# Altium project UltraZohm_Analog_Adapter_MAX11331.PrjPcb
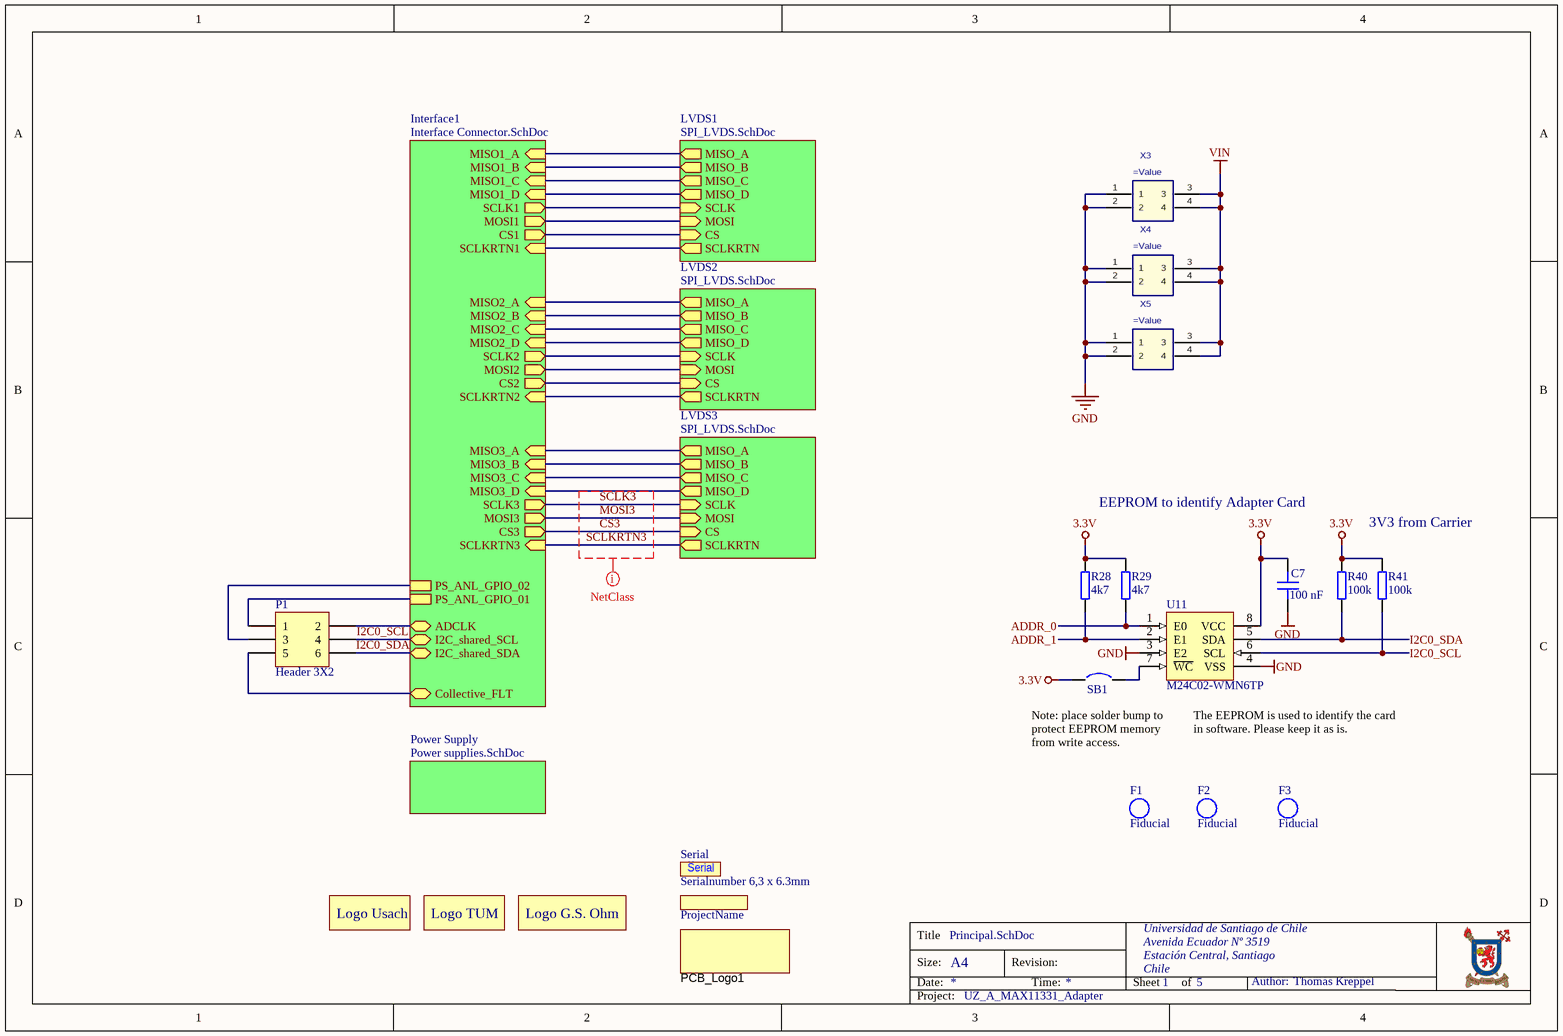
[diagram p0: Principal.SchDoc]
Author: Thomas Kreppel; Date: 10/2025; ProjectName: UZ_A_MAX11331_Adapter; ProjectRevision: Rev03
4 sheets, 150 parts. Net scope: hierarchical (ports join the sheet entries above them; power ports are global).
Board file: UltraZohm_Analog_Adapter_MAX11331.PcbDoc
Sheets:
  Principal.SchDoc
    Power Supply = Power supplies.SchDoc
    Interface1 = Interface Connector.SchDoc
    LVDS1 = SPI_LVDS.SchDoc
    LVDS2 = SPI_LVDS.SchDoc
    LVDS3 = SPI_LVDS.SchDoc

## Sheet Principal.SchDoc
size A4; Author: Thomas Kreppel; CompanyName: Universidad de Santiago de Chile; Address1: Avenida Ecuador Nº 3519; Address2: Estación Central, Santiago; Address3: Chile; DocumentNumber: 1; Revision: Rev03; SheetNumber: 1; SheetTotal: 5

### Parts
C7  100 nF  [C_0603]
F1  Fiducial  [Fiducial_1.7mm]  (no BOM)
F2  Fiducial  [Fiducial_1.7mm]  (no BOM)
F3  Fiducial  [Fiducial_1.7mm]  (no BOM)
Logo1  LOGO USACH  [Logo Usach]  (value not drawn)  (no BOM)
Logo2  LOGO TUM  [Logo TUM]  (value not drawn)  (no BOM)
Logo3  LOGO G.S. Ohm  [Logo G.S.Ohm University]  (value not drawn)  (no BOM)
P1  Header 3X2  [HDR2X3]  (no BOM)
PCB_Logo1  ESD Susceptible  [ESD_Overlay_Medium]  (value not drawn)  (no BOM)
ProjectName  Project Name, Rev  [ID_ProjectRev]  (value not drawn)  (no BOM)
R28  4k7  [RES 0603_1608]
R29  4k7  [RES 0603_1608]
R40  100k  [RES 0603_1608]
R41  100k  [RES 0603_1608]
SB1  Solder Bump 0603  [SB_0603]  (value not drawn)  (no BOM)
Serial  Serialnumber 6,3 x 6.3mm  [Serial_6.3x6.3mm]  (no BOM)
U11  M24C02-WMN6TP  [D0008A_N]
X3  (no value)  [IPL1-102-01-L-D-K]
X4  (no value)  [IPL1-102-01-L-D-K]
X5  (no value)  [IPL1-102-01-L-D-K]

### Sub-sheets
Interface1 = Interface Connector.SchDoc: MISO2_B (in), MOSI3 (out), SCLK1 (out), MISO3_A (in), SCLK2 (out), CS1 (out), MISO1_A (in), MISO1_C (in), MISO2_C (in), PS_ANL_GPIO_02, MOSI1 (out), Collective_FLT (bidir), SCLKRTN2 (in), MOSI2 (out), SCLKRTN3 (in), MISO3_B (in), CS2 (out), SCLKRTN1 (in), ADCLK (bidir), MISO1_D (in), CS3 (out), MISO3_D (in), MISO3_C (in), MISO1_B (in), MISO2_A (in), MISO2_D (in), I2C_shared_SDA (bidir), PS_ANL_GPIO_01, SCLK3 (out), I2C_shared_SCL (bidir)
LVDS1 = SPI_LVDS.SchDoc: SCLKRTN (out), MOSI (in), MISO_C (out), MISO_A (out), MISO_D (out), MISO_B (out), SCLK (in), CS (in)
LVDS2 = SPI_LVDS.SchDoc: SCLKRTN (out), MOSI (in), MISO_C (out), MISO_A (out), MISO_D (out), MISO_B (out), SCLK (in), CS (in)
LVDS3 = SPI_LVDS.SchDoc: SCLKRTN (out), MOSI (in), MISO_C (out), MISO_A (out), MISO_D (out), MISO_B (out), SCLK (in), CS (in)
Power Supply = Power supplies.SchDoc: no entries

### Nets
3.3V: C7.1 R28.2 R29.2 R40.2 R41.2 SB1.1 U11.8(VCC)
GND: C7.2 U11.3(E2) U11.4(VSS) X3.1 X3.2 X4.1 X4.2 X5.1 X5.2
VIN: X3.3 X3.4 X4.3 X4.4 X5.3 X5.4
ADCLK: P1.2 ; sheet Interface1/ADCLK
ADDR_0: R29.1 U11.1(E0)
ADDR_1: R28.1 U11.2(E1)
Collective_FLT: P1.5 ; sheet Interface1/Collective_FLT
CS: sheet Interface1/CS2, sheet LVDS2/CS
CS1: sheet Interface1/CS1, sheet LVDS1/CS
CS3: sheet Interface1/CS3, sheet LVDS3/CS
I2C0_SCL: P1.4 R41.1 U11.6(SCL) ; sheet Interface1/I2C_shared_SCL
I2C0_SDA: P1.6 R40.1 U11.5(SDA) ; sheet Interface1/I2C_shared_SDA
MISO1_A: sheet Interface1/MISO1_A, sheet LVDS1/MISO_A
MISO1_B: sheet Interface1/MISO1_B, sheet LVDS1/MISO_B
MISO1_C: sheet Interface1/MISO1_C, sheet LVDS1/MISO_C
MISO1_D: sheet Interface1/MISO1_D, sheet LVDS1/MISO_D
MISO2_A: sheet Interface1/MISO2_A, sheet LVDS2/MISO_A
MISO2_B: sheet Interface1/MISO2_B, sheet LVDS2/MISO_B
MISO2_C: sheet Interface1/MISO2_C, sheet LVDS2/MISO_C
MISO2_D: sheet Interface1/MISO2_D, sheet LVDS2/MISO_D
MISO3_A: sheet Interface1/MISO3_A, sheet LVDS3/MISO_A
MISO3_B: sheet Interface1/MISO3_B, sheet LVDS3/MISO_B
MISO3_C: sheet Interface1/MISO3_C, sheet LVDS3/MISO_C
MISO3_D: sheet Interface1/MISO3_D, sheet LVDS3/MISO_D
MOSI1: sheet Interface1/MOSI1, sheet LVDS1/MOSI
MOSI2: sheet Interface1/MOSI2, sheet LVDS2/MOSI
MOSI3: sheet Interface1/MOSI3, sheet LVDS3/MOSI
PS_ANL_GPIO_01: P1.1 ; sheet Interface1/PS_ANL_GPIO_01
PS_ANL_GPIO_02: P1.3 ; sheet Interface1/PS_ANL_GPIO_02
SCLK1: sheet Interface1/SCLK1, sheet LVDS1/SCLK
SCLK2: sheet Interface1/SCLK2, sheet LVDS2/SCLK
SCLK3: sheet Interface1/SCLK3, sheet LVDS3/SCLK
SCLKRTN: sheet Interface1/SCLKRTN1, sheet LVDS1/SCLKRTN
SCLKRTN: sheet Interface1/SCLKRTN2, sheet LVDS2/SCLKRTN  [a separate net that carries the same name]
SCLKRTN3: sheet Interface1/SCLKRTN3, sheet LVDS3/SCLKRTN
NetSB1_2: SB1.2 U11.7(~{WC})

### Layout directives
net class SPI_C: CS3, MOSI3, SCLK3, SCLKRTN3

### Notes on the sheet
- EEPROM to identify Adapter Card
- 3V3 from Carrier
- Note: place solder bump to protect EEPROM memory from write access.
- (near U11) The EEPROM is used to identify the card in software. Please keep it as is.
- Title
- Size:
- Date:
- A4
- Revision:
- Time:
- Sheet
- of
- Author:
- Project:
- (in symbol LOGO G.S. Ohm) Logo G.S. Ohm
- (in symbol LOGO TUM) Logo TUM
- (in symbol LOGO USACH) Logo Usach

### Library data of the parts
C7 = C0603C104K9PACTU: Capacitor 0603, 6.3 VDC, 100 nF, X5R; Manufacturer: KEMET; Tolerance: 10 %; Voltage Rating: 6.3 VDC; Created from: MGremer; Manufacturer Part Number: C0603C104K9PACTU; PartID: 70; Created On: 20.12.2020 13:54:13; ComponentLink1Description: Datasheet; ComponentLink1URL: https://www.mouser.de/datasheet/2/212/KEM_C1006_X5R_SMD-1103249.pdf; Component Type: Capacitor 0603; Device Package: 0603; Last Updated: 20.01.2021 13:57:36; Mounting Type: SMD; Operating Temperature: -55 - 85°C; Series: SMD Comm X5R; Supplier 1: Mouser; Supplier Part Number 1: 80-C0603C104K9P; Type: Capacitor; Value: 100 nF; Live Cycle Status: 1; Stock number: not stored; LCSC Part Number: C14663
F1-F3 = Fiducial: Fiducial for Assembler
P1 = Header 3X2: Header, 3-Pin, Dual row; LatestRevisionDate: 17-Jul-2002; LatestRevisionNote: Re-released for DXP Platform.; Publisher: Altium Limited
PCB_Logo1 = LOGO_ESD_Susceptible: ESD Susceptible Symbol; Created: 2018_11_25_AGeiger; Value: ESD Susceptible
ProjectName = ID_ProjectRev: Project Name and Revision Number; Created: 2018_11_23_AGeiger; Value: Project Name, Rev
R28 R29 = 0603WAF4701T5E: SMD resistor E24 series; Manufacturer: UNI-ROYAL; Tolerance: 1%; Created from: AGeiger; Manufacturer Part Number: 0603WAF4701T5E; PartID: 90; Created On: 14.12.2020 16:17:14; ComponentLink1Description: Datasheet; ComponentLink1URL: https://datasheet.lcsc.com/lcsc/2206010116_UNI-ROYAL-Uniroyal-Elec-0603WAF4701T5E_C23162.pdf; Component Type: SMD resistor; Device Package: 0603; Last Updated: 25.08.2022 20:03:04; Mounting Type: SMD; Supplier 1: LCSC; Supplier Part Number 1: C23162; Type: Resistor; Value: 4k7; Live Cycle Status: 1; Stock number: Labor SMD Container; LCSC Part Number: C23162
R40 R41 = RK73B1JTTD104J: SMD resistor E24 series; Manufacturer: KOA Speer; Tolerance: 5%; Created from: MGremer; Manufacturer Part Number: RK73B1JTTD104J; PartID: 122; Created On: 14.12.2020 16:17:14; ComponentLink1Description: Datasheet; ComponentLink1URL: https://www.mouser.de/datasheet/2/219/RK73B-1825463.pdf; Component Type: SMD resistor; Device Package: 0603; Last Updated: 27.05.2022 14:04:10; Mounting Type: SMD; Supplier 1: Mouser; Supplier Part Number 1: 660-RK73B1JTTD104J; Type: Resistor; Value: 100k; Live Cycle Status: 1; Stock number: Labor SMD Container; LCSC Part Number: C25803
SB1 = =Value: Created from: AGeiger; Revision: July-2002: Re-released for DXP Platform.; PartID: 1; Created On: 09.01.2024 17:13:56; Component Type: Solder Bump; Device Package: 0603; Last Updated: 09.01.2024 17:13:56; Manufacturer Part Number: Solder Bump 0603; Mounting Type: SMD; Value: Solder Bump 0603
Serial = SerialNumber: Created: 2018_09_18_AGeiger; Value: Serialnumber 6,3 x 6.3mm
U11 = M24C02-WMN6TP: 2Kbit I2C SOP-8 EEPROM ROHS; Manufacturer: STMicroelectronics; Created from: AGeiger; Manufacturer Part Number: M24C02-WMN6TP; PartID: 1; Created On: 19.11.2023 14:54:27; ComponentLink1Description: Datasheet; ComponentLink1URL: https://www.st.com/resource/en/datasheet/m24c01-w.pdf; Component Type: EEPROM; Device Package: SOIC-8; Last Updated: 19.11.2023 21:39:04; Mounting Type: SMD; Operating Temperature: -40 to +85 °C; Series: M24xxx; Supplier 1: Mouser; Supplier Part Number 1: 511-M24C02-WMN6TP; Supplier 2: LCSC; Supplier Part Number 2: C7562; Type: Memory; Value: M24C02-WMN6TP; LCSC Part Number: C7562
X3-X5 = IPL1-102-XX-X-D-X: 2.54mm Double Row Terminal Assembly, Right-Angled; MF: SAMTEC; Created: 2018_05_02_AGeiger; Value: =MPN; MPN: IPL1-102-01-L-D-K; Supplier 1: Digikey; Supplier Part Number 1: SAM10565-ND

## Sheet Power supplies.SchDoc
size A4; Author: T. Kreppel; CompanyName: Universidad de Santiago de Chile; Address1: Avenida Ecuador Nº 3519; Address2: Estación Central, Santiago; Address3: Chile; DocumentNumber: 5; Revision: Rev03; SheetNumber: 5; SheetTotal: 5
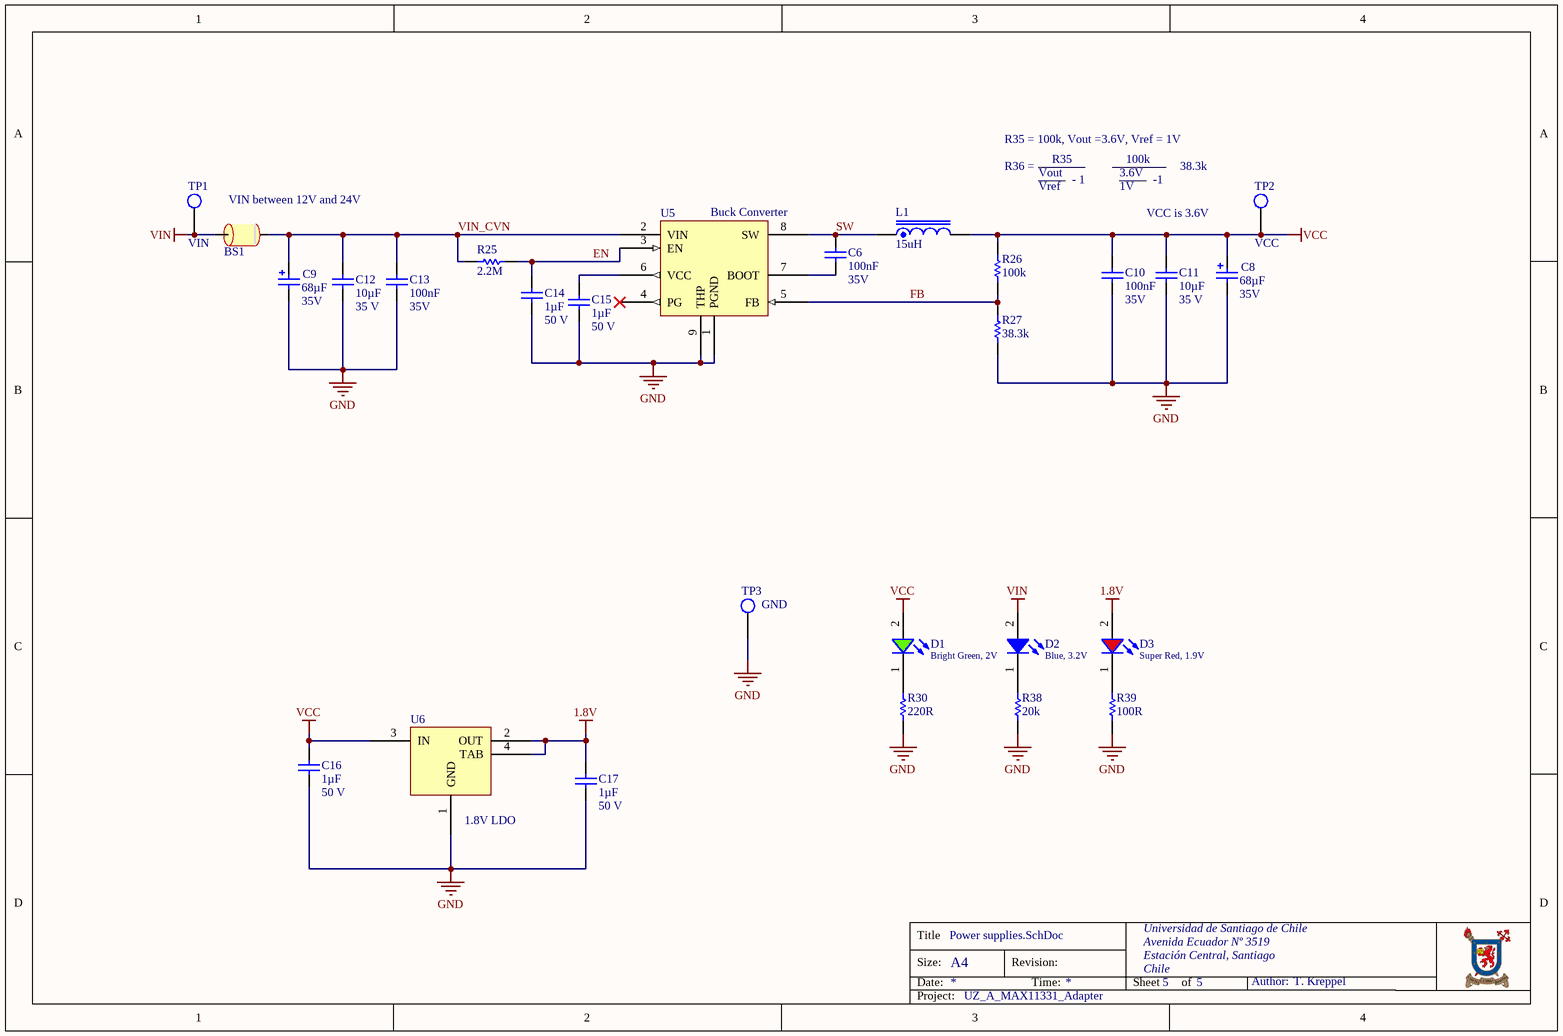
[diagram p1: Power supplies.SchDoc]

### Parts
BS1  Ferrite bead  [RES_1206]  (value not drawn)
C6  100nF  Voltage: 35V  [CAP_0603]
C8  68µF  Voltage: 35V  [WCAP-ATG8_6.3x11]
C9  68µF  Voltage: 35V  [WCAP-ATG8_6.3x11]
C10  100nF  Voltage: 35V  [CAP_0603]
C11  10µF  Voltage: 35 V  [RES_1206]
C12  10µF  Voltage: 35 V  [RES_1206]
C13  100nF  Voltage: 35V  [CAP_0603]
C14  1µF  Voltage: 50 V  [CAP_0603]
C15  1µF  Voltage: 50 V  [CAP_0603]
C16  1µF  Voltage: 50 V  [CAP_0603]
C17  1µF  Voltage: 50 V  [CAP_0603]
D1  Bright Green, 2V  [WL-SMCW_0603_H=0.7mm]
D2  Blue, 3.2V  [WL-SMCW_0603_H=0.7mm]
D3  Super Red, 1.9V  [WL-SMCW_0603_H=0.7mm]
L1  15uH  [SMT_inductor_1050_Performance]
R25  2.2M  [RES_0603]
R26  100k  [RES_0603]
R27  38.3k  [RES_0603]
R30  220R  [RES_0603]
R38  20k  [RES_0603]
R39  100R  [RES_0603]
TP1  VIN  [TP_1.6mm]  (no BOM)
TP2  VCC  [TP_1.6mm]  (no BOM)
TP3  GND  [TP_1.6mm]  (no BOM)
U5  Buck Converter  [SOIC127P600X170_HS-9N]
U6  1.8V LDO  [SOT230P700X170-4N]

### Nets
1.8V: C17.1 D3.2(A) U6.2(OUT) U6.4(TAB)
GND: C8.1(N) C9.1(N) C10.2 C11.2 C12.2 C13.2 C14.2 C15.2 C16.2 C17.2 R27.1 R30.1 R38.2 R39.2 TP3.1 U5.1(PGND) U5.9(THP) U6.1(GND)
VCC: C8.2(P) C10.1 C11.1 C16.1 D1.2(A) L1.2 R26.2 TP2.1 U6.3(IN)
VIN: BS1.1 D2.2(A) TP1.1
EN: C14.1 R25.1 U5.3(EN)
FB: R26.1 R27.2 U5.5(FB)
SW: C6.1 L1.1 U5.8(SW)
VIN_CVN: BS1.2 C9.2(P) C12.1 C13.1 R25.2 U5.2(VIN)
NetC6_2: C6.2 U5.7(BOOT)
NetC15_1: C15.1 U5.6(VCC)
NetD1_1: D1.1(K) R30.2
NetD2_1: D2.1(K) R38.1
NetD3_1: D3.1(K) R39.1

Not connected (* = marked no-connect by the designer): U5 4(PG)*

### Notes on the sheet
- R35 = 100k, Vout =3.6V, Vref = 1V
- R36 =
- Vout
- R35
- 3.6V
- 100k
- 38.3k
- VIN between 12V and 24V
- Vref
- - 1
- 1V
- VCC is 3.6V
- -1
- Title
- Size:
- Date:
- A4
- Revision:
- Time:
- Sheet
- of
- Author:
- Project:

### Library data of the parts
BS1 = Bead: 6A; MPN: 742792121; MF: Würth Elektronik; DCR: 60mOhm; I_r: 3A; Supplier 1: Digikey; Supplier Part Number 1: 732-4654-1-ND; Package: 1206; LCSC Part Number: C5271178
C6 = Cap_0603: Capacitor; MPN: C0603C104M5RACTU; Rule: PcbType=ProtelPcb; MF: KEMET; Dielectricum: X7R; Tolerance: 10%; Published: 8-Jun-2000; LatestRevisionDate: 17-Jul-2002; LatestRevisionNote: Re-released for DXP Platform.; PackageReference: RAD-0.3; Publisher: Altium Limited; Value: 100nF; Supplier 1: Digikey; Supplier 2: Mouser; Supplier Part Number 1: 399-7845-1-ND; Package: 0603; LCSC Part Number: C14663
C8 C9 = 860010573006: WCAP-ATG8 THT Aluminum Electrolytic Capacitors, D6.3mm x L11mm, 68uF, +/-20%, 35VDC; Dissipation Factor: 12%; Endurance: 2000h; Leakage Current: 23.8uA; Ripple Current max.: 198mA; Technical Reference: ATBD110680M035DSPA4B000; ComponentLink1Description: Manufacturer; ComponentLink1URL: http://www.we-online.de; ComponentLink2Description: Datasheet; ComponentLink2URL: https://katalog.we-online.com/pbs/datasheet/860010573006.pdf; Length: 11mm; Mounting Technology: THT; Operating Temperature: -40 to +85degC; Packaging: Ammo Pack; Published Date: August 2019; Value: 68µF; Diameter: 6.3mm; Part Number: 860010573006; Publisher: Wurth Elektronik; Tolerance: +/-20%; Supplier 1: Digikey; Supplier Part Number 1: 732-8736-1-ND; LCSC Part Number: C1668506
C10 C13 = Cap_0603: Capacitor; MPN: C0603C104M5RACTU; Rule: PcbType=ProtelPcb; MF: KEMET; Tolerance: 10%; Dielectricum: X7R; Published: 8-Jun-2000; LatestRevisionDate: 17-Jul-2002; LatestRevisionNote: Re-released for DXP Platform.; PackageReference: RAD-0.3; Publisher: Altium Limited; Value: 100nF; Supplier 1: Digikey; Supplier Part Number 1: 399-7845-1-ND; Package: 0603; LCSC Part Number: C14663
C11 C12 = Cap_1206: Capacitor; MPN: GRM319R6YA106KA12D; Dielectricum: X7R; Tolerance: 10%; Value: 10µF; Supplier 1: Digikey; Supplier Part Number 1: 490-9964-1-ND; MF: *; Package: 1206; LCSC Part Number: C123678
C14 C16 C17 = Cap_0603: Capacitor Ceramic; MPN: C0603C105K3RACTU; MF: KEMET; Tolerance: 10%; Dielectricum: X7R; Value: 1µF; Supplier 1: Digikey; Supplier Part Number 1: 399-7376-1-ND; Package: 0603; LCSC Part Number: C2177372
C15 = Cap_0603: Capacitor Ceramic; MPN: C0603C105K3RACTU; MF: KEMET; Dielectricum: X7R; Tolerance: 10%; Value: 1µF; Supplier 1: Digikey; Supplier Part Number 1: 399-7376-1-ND; Package: 0603; LCSC Part Number: C2177372
D1 = 150060VS75000: WL-SMCW SMT Mono-color Chip LED Waterclear, size 0603, Bright Green, 2V, 140deg; Chip Technology: AlInGaP; Dominant Wavelength typ.: 570nm; Luminous Intensity typ.: 40mcd; Peak Wavelength typ.: 572nm; MF: Wurth Elektronik; Viewing Angle: 140deg; ComponentLink1Description: Manufacturer; ComponentLink1URL: http://www.we-online.de; ComponentLink2URL: https://www.we-online.com/catalog/datasheet/150060VS75000.pdf; ComponentLink2Description: Datasheet; Forward Voltage typ.: 2V; Emitting Color: Bright Green; Mounting Technology: SMT; Operating Temperature: -40 to +85degC; Published Date: December 2019; MPN: 150060VS75000; Packaging: Tape and Reel; Size: 0603; Supplier 1: Digikey; Supplier Part Number 1: 732-4980-1-ND; Package: 0603
D2 = 150060BS75000: WL-SMCW SMT Mono-color Chip LED Waterclear, size 0603, Blue, 3.2V, 140deg; Chip Technology: InGaN; Dominant Wavelength typ.: 470nm; Luminous Intensity typ.: 145mcd; Peak Wavelength typ.: 465nm; MF: Wurth Elektronik; Viewing Angle: 140deg; ComponentLink1Description: Manufacturer; ComponentLink1URL: http://www.we-online.de; ComponentLink2URL: https://www.we-online.com/catalog/datasheet/150060BS75000.pdf; ComponentLink2Description: Datasheet; Forward Voltage typ.: 3.2V; Emitting Color: Blue; Mounting Technology: SMT; Operating Temperature: -40 to +85degC; Published Date: December 2019; MPN: 150060BS75000; Packaging: Tape and Reel; Size: 0603; Supplier 1: Digikey; Supplier Part Number 1: 732-4966-1-ND; Package: 0603
D3 = 150060SS75000: WL-SMCW SMT Mono-color Chip LED Waterclear, size 0603, Super Red, 1.9V, 140deg; Chip Technology: AlInGaP; Dominant Wavelength typ.: 630nm; Luminous Intensity typ.: 60mcd; Peak Wavelength typ.: 645nm; MF: Wurth Elektronik; Viewing Angle: 140deg; ComponentLink1Description: Manufacturer; ComponentLink1URL: http://www.we-online.de; ComponentLink2URL: https://www.we-online.com/catalog/datasheet/150060SS75000.pdf; ComponentLink2Description: Datasheet; Forward Voltage typ.: 1.9V; Emitting Color: Super Red; Mounting Technology: SMT; Operating Temperature: -40 to +85degC; Published Date: December 2019; MPN: 150060SS75000; Packaging: Tape and Reel; Size: 0603; Supplier 1: Digikey; Supplier Part Number 1: 732-4979-1-ND; Package: 0603
L1 = B82464G4154M: SMT power Inductor, 15uH, 40m DRC; Rated Current: 3.7 A; MF: Murata; Supplier 1: Digikey; Supplier Part Number 1: 811-3837-1-ND; Value: 15uH; DCR: 40m; Supplier 2: Mouser; LCSC Part Number: C6818993
R25 = Res0603: MPN: RC0603FR-072M2L; MF: Yageo; Tolerance: 1%; Published: 8-Jun-2000; LatestRevisionDate: 17-Jul-2002; LatestRevisionNote: Re-released for DXP Platform.; PackageReference: AXIAL-0.3; Publisher: Altium Limited; PackageDescription: Axial Device, Thru-Hole; 2 Leads; 0.3 in Pin Spacing; Value: 2.2M; Supplier 1: Digikey; Supplier Part Number 1: YAG3329CT-ND; Package: 0603
R26 = Res0603: MPN: RC0603FR-07100KL; MF: Yageo; Tolerance: 1%; Published: 8-Jun-2000; LatestRevisionDate: 17-Jul-2002; LatestRevisionNote: Re-released for DXP Platform.; PackageReference: AXIAL-0.3; Publisher: Altium Limited; PackageDescription: Axial Device, Thru-Hole; 2 Leads; 0.3 in Pin Spacing; Value: 100k; Supplier 1: Digikey; Supplier Part Number 1: 311-100KHRCT-ND; Package: 0603
R27 R39 = Res0603: Tolerance: 1%; Published: 8-Jun-2000; LatestRevisionDate: 17-Jul-2002; LatestRevisionNote: Re-released for DXP Platform.; PackageReference: AXIAL-0.3; Publisher: Altium Limited; PackageDescription: Axial Device, Thru-Hole; 2 Leads; 0.3 in Pin Spacing; Supplier 1: Digikey; Package: 0603
  R27: Value: 38.3k; Supplier 2: Mouser; Supplier Part Number 1: 311-38.3KHRCT-ND
  R39: Value: 100R; Supplier Part Number 1: 311-100HRCT-ND; LCSC Part Number: C22775
R30 = Res0603: MPN: RC0603JR-07220RL; Tolerance: 1%; Published: 8-Jun-2000; LatestRevisionDate: 17-Jul-2002; LatestRevisionNote: Re-released for DXP Platform.; PackageReference: AXIAL-0.3; Publisher: Altium Limited; PackageDescription: Axial Device, Thru-Hole; 2 Leads; 0.3 in Pin Spacing; Value: 220R; Supplier 1: Digikey; Supplier 2: Mouser; Supplier Part Number 1: 311-220GRCT-ND; Package: 0603; LCSC Part Number: C1226
R38 = Res0603: MPN: RC0603FR-07330RL; Tolerance: 1%; Published: 8-Jun-2000; LatestRevisionDate: 17-Jul-2002; LatestRevisionNote: Re-released for DXP Platform.; PackageReference: AXIAL-0.3; Publisher: Altium Limited; PackageDescription: Axial Device, Thru-Hole; 2 Leads; 0.3 in Pin Spacing; Value: 20k; Supplier 1: Digikey; Supplier Part Number 1: 311-330HRCT-ND; Package: 0603; LCSC Part Number: C4184
TP1-TP3 = TP: 1.6mm Test Point Keystone; MPN: 5006; MF: Keystone Electronics; Created: 2020_04_Kreppel; Supplier 1: Digikey; Supplier Part Number 1: 36-5006-ND
U5 = LMR33620A: 3.8V to 36V, 2A synchronous step-down converter; MPN: LMR33620ADDA; Switching frequency: 400kHz; MF: Texas Instruments; Created: 4/20 Kreppel; Supplier 1: Digikey; Supplier Part Number 1: 296-48841-ND; Supplier 2: Mouser; LCSC Part Number: C2071694
U6 = TLV1117LV18DCYR: 1A Positive 1.8V Fixed-Voltage Low-Dropout Regulator; MF: Texas Instruments; Voltage Input Max: 5.5 V; Created: 2020_04_Kreppel; MPN: TLV1117LV18DCYR; Supplier 1: Digikey; Supplier Part Number 1: 296-28777-1-ND; Voltage Output: 1.8 V; Current Max: 1 A; Supplier 2: Mouser; Supplier Part Number 2: 595-TLV1117-18IDCYR; LCSC Part Number: C80105

## Sheet Interface Connector.SchDoc
size A4; Author: Thomas Kreppel; CompanyName: Universidad de Santiago de Chile; Address1: Avenida Ecuador Nº 3519; Address2: Estación Central, Santiago; Address3: Chile; DocumentNumber: 2; Revision: Rev03; SheetNumber: 2; SheetTotal: 5
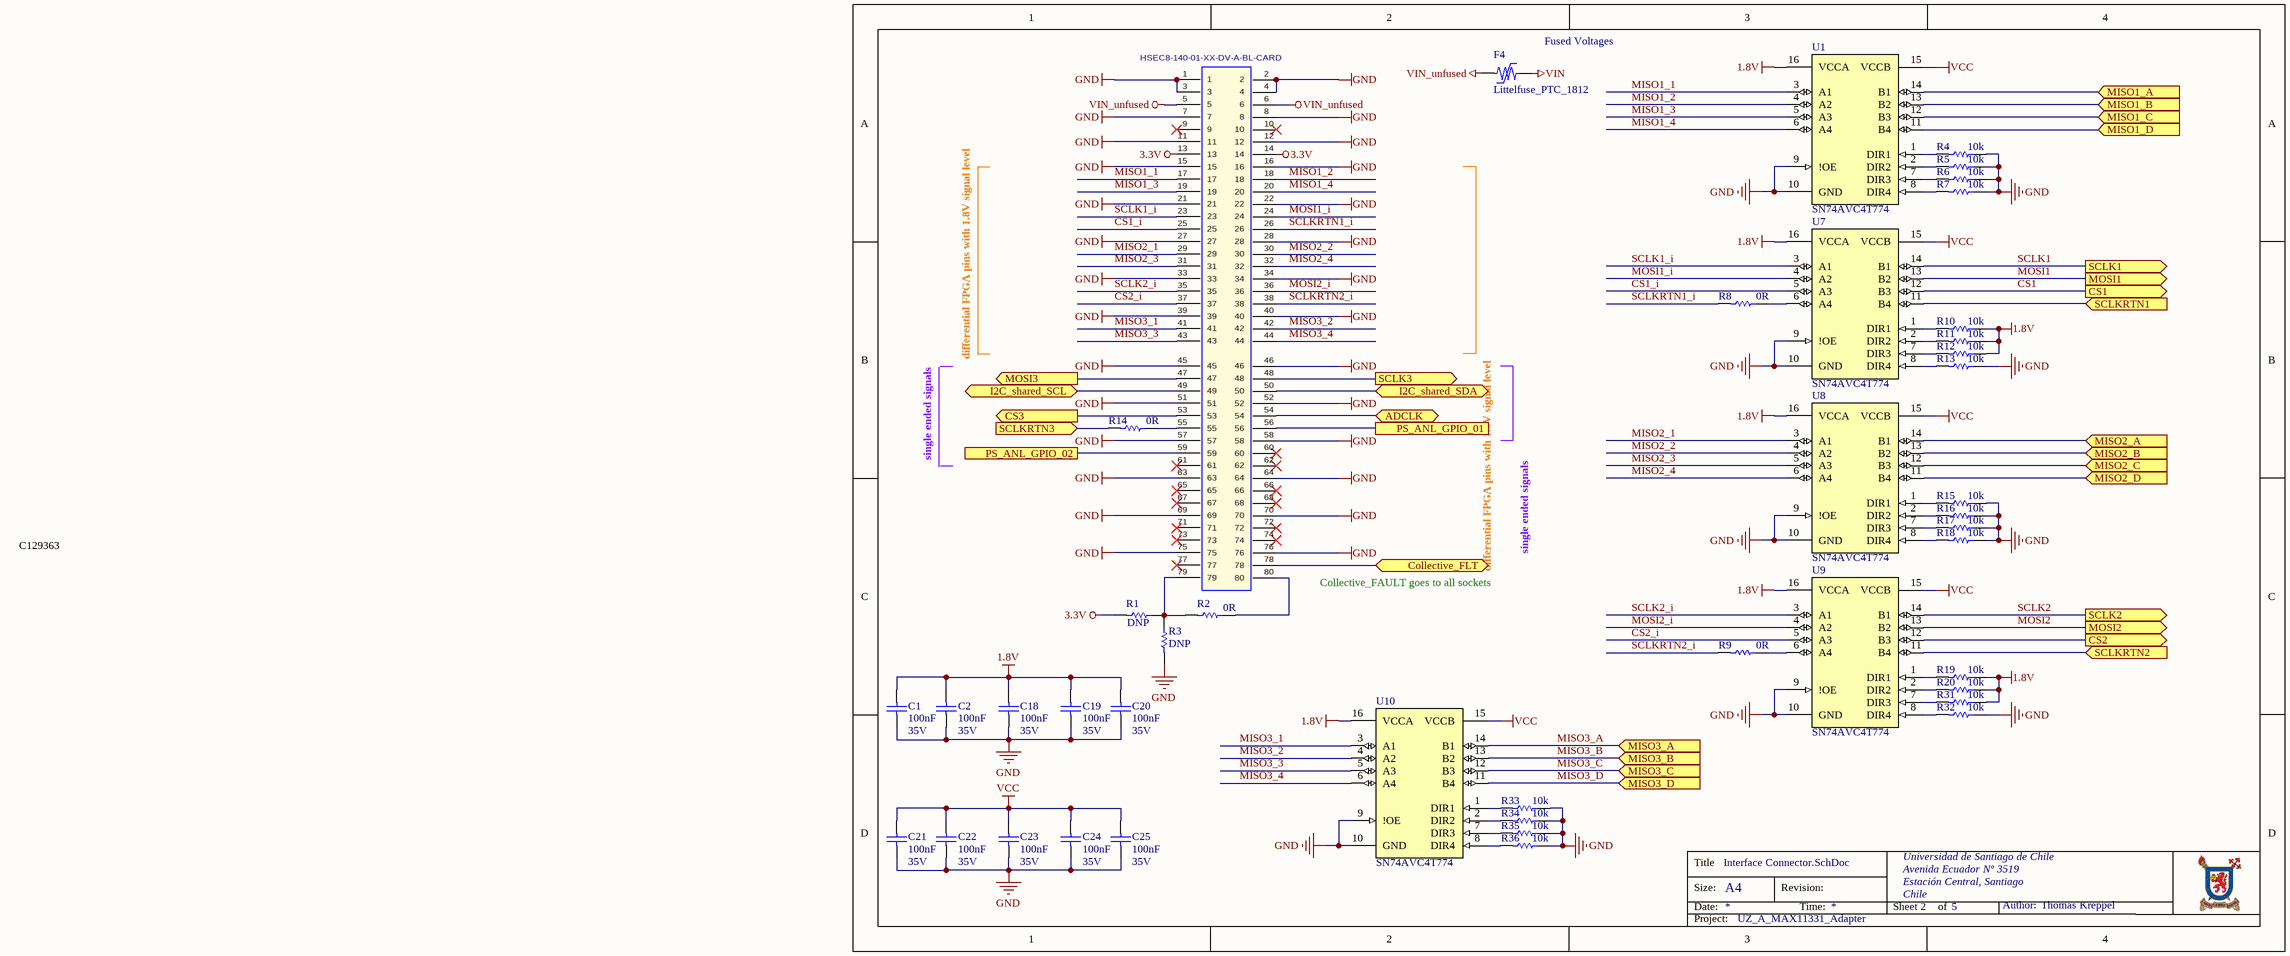
[diagram p2: Interface Connector.SchDoc]

### Parts
C1  100nF  Voltage: 35V  [CAP_0603]
C2  100nF  Voltage: 35V  [CAP_0603]
C18  100nF  Voltage: 35V  [CAP_0603]
C19  100nF  Voltage: 35V  [CAP_0603]
C20  100nF  Voltage: 35V  [CAP_0603]
C21  100nF  Voltage: 35V  [CAP_0603]
C22  100nF  Voltage: 35V  [CAP_0603]
C23  100nF  Voltage: 35V  [CAP_0603]
C24  100nF  Voltage: 35V  [CAP_0603]
C25  100nF  Voltage: 35V  [CAP_0603]
F4  Littelfuse_PTC_1812  [1812_PTC_Polyfuse_Littelfuse]
R1  DNP  [RES_0603]  (no BOM)
R2  0R  [RES_0603]
R3  DNP  [RES_0603]  (no BOM)
R4  10k  [RES_0603]
R5  10k  [RES_0603]
R6  10k  [RES_0603]
R7  10k  [RES_0603]
R8  0R  [RES_0603]
R9  0R  [RES_0603]
R10  10k  [RES_0603]
R11  10k  [RES_0603]
R12  10k  [RES_0603]
R13  10k  [RES_0603]
R14  0R  [RES_0603]
R15  10k  [RES_0603]
R16  10k  [RES_0603]
R17  10k  [RES_0603]
R18  10k  [RES_0603]
R19  10k  [RES_0603]
R20  10k  [RES_0603]
R31  10k  [RES_0603]
R32  10k  [RES_0603]
R33  10k  [RES_0603]
R34  10k  [RES_0603]
R35  10k  [RES_0603]
R36  10k  [RES_0603]
U1  SN74AVC4T774  [TSOP65P640X120-16N]
U7  SN74AVC4T774  [TSOP65P640X120-16N]
U8  SN74AVC4T774  [TSOP65P640X120-16N]
U9  SN74AVC4T774  [TSOP65P640X120-16N]
U10  SN74AVC4T774  [TSOP65P640X120-16N]
X1  HSEC8-140-01-XX-DV-A-BL-CARD  [HSEC8-140-01-XX-DV-A-BL-CARD]  (no BOM)

### Ports
ADCLK (bidir), Collective_FLT (bidir), CS1 (out), CS2 (out), CS3 (out), I2C_shared_SCL (bidir), I2C_shared_SDA (bidir), MISO1_A (in), MISO1_B (in), MISO1_C (in), MISO1_D (in), MISO2_A (in), MISO2_B (in), MISO2_C (in), MISO2_D (in), MISO3_A (in), MISO3_B (in), MISO3_C (in), MISO3_D (in), MOSI1 (out), MOSI2 (out), MOSI3 (out), PS_ANL_GPIO_01, PS_ANL_GPIO_02, SCLK1 (out), SCLK2 (out), SCLK3 (out), SCLKRTN1 (in), SCLKRTN2 (in), SCLKRTN3 (in)

### Nets
1.8V: C1.1 C2.1 C18.1 C19.1 C20.1 R10.1 R11.1 R12.1 R19.1 R20.1 R31.1 U1.16(VCCA) U7.16(VCCA) U8.16(VCCA) U9.16(VCCA) U10.16(VCCA)
3.3V: R1.2 X1.13 X1.14
GND: C1.2 C2.2 C18.2 C19.2 C20.2 C21.2 C22.2 C23.2 C24.2 C25.2 R3.2 R4.1 R5.1 R6.1 R7.1 R13.1 R15.1 R16.1 R17.1 R18.1 R32.1 R33.1 R34.1 R35.1 R36.1 U1.9(!OE) U1.10(GND) U7.9(!OE) U7.10(GND) U8.9(!OE) U8.10(GND) U9.9(!OE) U9.10(GND) U10.9(!OE) U10.10(GND) X1.1 X1.2 X1.3 X1.4 X1.7 X1.8 X1.11 X1.12 X1.15 X1.16 X1.21 X1.22 X1.27 X1.28 X1.33 X1.34 X1.39 X1.40 X1.45 X1.46 X1.51 X1.52 X1.57 X1.58 X1.63 X1.64 X1.69 X1.70 X1.75 X1.76
VCC: C21.1 C22.1 C23.1 C24.1 C25.1 U1.15(VCCB) U7.15(VCCB) U8.15(VCCB) U9.15(VCCB) U10.15(VCCB)
VIN: F4.2
VIN_unfused: F4.1 X1.5 X1.6
ADCLK: X1.54 ; port ADCLK
Collective_FLT: X1.78 ; port Collective_FLT
CS: U9.12(B3) ; port CS2
CS1: U7.12(B3) ; port CS1
CS1_i: U7.5(A3) X1.25
CS2_i: U9.5(A3) X1.37
CS3: X1.53 ; port CS3
I2C0_SCL: X1.49 ; port I2C_shared_SCL
I2C0_SDA: X1.50 ; port I2C_shared_SDA
MISO1_1: U1.3(A1) X1.17
MISO1_2: U1.4(A2) X1.18
MISO1_3: U1.5(A3) X1.19
MISO1_4: U1.6(A4) X1.20
MISO1_A: U1.14(B1) ; port MISO1_A
MISO1_B: U1.13(B2) ; port MISO1_B
MISO1_C: U1.12(B3) ; port MISO1_C
MISO1_D: U1.11(B4) ; port MISO1_D
MISO2_1: U8.3(A1) X1.29
MISO2_2: U8.4(A2) X1.30
MISO2_3: U8.5(A3) X1.31
MISO2_4: U8.6(A4) X1.32
MISO2_A: U8.14(B1) ; port MISO2_A
MISO2_B: U8.13(B2) ; port MISO2_B
MISO2_C: U8.12(B3) ; port MISO2_C
MISO2_D: U8.11(B4) ; port MISO2_D
MISO3_1: U10.3(A1) X1.41
MISO3_2: U10.4(A2) X1.42
MISO3_3: U10.5(A3) X1.43
MISO3_4: U10.6(A4) X1.44
MISO3_A: U10.14(B1) ; port MISO3_A
MISO3_B: U10.13(B2) ; port MISO3_B
MISO3_C: U10.12(B3) ; port MISO3_C
MISO3_D: U10.11(B4) ; port MISO3_D
MOSI1: U7.13(B2) ; port MOSI1
MOSI1_i: U7.4(A2) X1.24
MOSI2: U9.13(B2) ; port MOSI2
MOSI2_i: U9.4(A2) X1.36
MOSI3: X1.47 ; port MOSI3
PS_ANL_GPIO_01: X1.56 ; port PS_ANL_GPIO_01
PS_ANL_GPIO_02: X1.59 ; port PS_ANL_GPIO_02
SCLK1: U7.14(B1) ; port SCLK1
SCLK1_i: U7.3(A1) X1.23
SCLK2: U9.14(B1) ; port SCLK2
SCLK2_i: U9.3(A1) X1.35
SCLK3: X1.48 ; port SCLK3
SCLKRTN: U7.11(B4) ; port SCLKRTN1
SCLKRTN: U9.11(B4) ; port SCLKRTN2  [a separate net that carries the same name]
SCLKRTN1_i: R8.2 X1.26
SCLKRTN2_i: R9.2 X1.38
SCLKRTN3: R14.2 ; port SCLKRTN3
NetR1_1: R1.1 R2.2 R3.1 X1.79
NetR2_1: R2.1 X1.80
NetR4_2: R4.2 U1.1(DIR1)
NetR5_2: R5.2 U1.2(DIR2)
NetR6_2: R6.2 U1.7(DIR3)
NetR7_2: R7.2 U1.8(DIR4)
NetR8_1: R8.1 U7.6(A4)
NetR9_1: R9.1 U9.6(A4)
NetR10_2: R10.2 U7.1(DIR1)
NetR11_2: R11.2 U7.2(DIR2)
NetR12_2: R12.2 U7.7(DIR3)
NetR13_2: R13.2 U7.8(DIR4)
NetR14_1: R14.1 X1.55
NetR15_2: R15.2 U8.1(DIR1)
NetR16_2: R16.2 U8.2(DIR2)
NetR17_2: R17.2 U8.7(DIR3)
NetR18_2: R18.2 U8.8(DIR4)
NetR19_2: R19.2 U9.1(DIR1)
NetR20_2: R20.2 U9.2(DIR2)
NetR31_2: R31.2 U9.7(DIR3)
NetR32_2: R32.2 U9.8(DIR4)
NetR33_2: R33.2 U10.1(DIR1)
NetR34_2: R34.2 U10.2(DIR2)
NetR35_2: R35.2 U10.7(DIR3)
NetR36_2: R36.2 U10.8(DIR4)

Not connected (* = marked no-connect by the designer): X1 9* 10* 60* 61* 62* 65* 66* 67* 68* 71* 72* 73* 74* 77*

### Notes on the sheet
- (near F4) Fused Voltages
- differential FPGA pins with 1.8V signal level
- (near F4) differential FPGA pins with 1.8V signal level
- single ended signals
- C129363
- Collective_FAULT goes to all sockets
- Title
- Size:
- Date:
- A4
- Revision:
- Time:
- Sheet
- of
- Author:
- Project:

### Library data of the parts
C1 C2 C18-C25 = Cap_0603: as C10 on sheet Power supplies; Published: 8-Jun-2000; LatestRevisionDate: 17-Jul-2002; LatestRevisionNote: Re-released for DXP Platform.; PackageReference: RAD-0.3; Publisher: Altium Limited; Value: 100nF; Supplier 1: Digikey; Supplier Part Number 1: 399-7845-1-ND; Package: 0603; LCSC Part Number: C14663
F4 = Littelfuse_PTC_1812: POLYSWITCH RESETTABLE DEVICES; MPN: miniASMDC110F/24; Value: PTC, 1.1 A, 24V; Voltage: 24V; Trip Current: 2.2A; Hold Current: 1.1A; Resistance: 0.18 Ohm; Type: Fuse; Nominal current: 1 A; Created from: MHlatky; MF: Littelfuse; Created: 2019_02_10_AGeiger; Package: 1812; ComponentLink1URL: https://www.littelfuse.com/~/media/electronics/datasheets/resettable_ptcs/littelfuse_ptc_surface_mount_catalog_datasheet.pdf.pdf; ComponentLink1Description: Datasheet; Manufacturer Part Number: Littelfuse_PTC_1812; PartID: 5; Created On: 07.05.2021 06:50:33; Component Type: Littelfuse_PTC_1812; Last Updated: 27.05.2022 15:06:17; Manufacturer: Littelfuse; Mounting Type: SMD; Operating Temperature: -40 - 85 °C; Supplier 1: Mouser; Supplier Part Number 1: 530-0ZCG0150BF2C; Live Cycle Status: 1; LCSC Part Number: C70119
R1 R3 = Res0603: MPN: CRCW06030000Z0EA; Value: 0; Tolerance: 1%; Published: 8-Jun-2000; LatestRevisionDate: 17-Jul-2002; LatestRevisionNote: Re-released for DXP Platform.; PackageReference: AXIAL-0.3; Publisher: Altium Limited; PackageDescription: Axial Device, Thru-Hole; 2 Leads; 0.3 in Pin Spacing; Supplier 1: Digikey; Supplier Part Number 1: 311-0.0GRCT-ND; Package: 0603
R2 = Res0603: MPN: CRCW06030000Z0EA; Tolerance: 1%; Published: 8-Jun-2000; LatestRevisionDate: 17-Jul-2002; LatestRevisionNote: Re-released for DXP Platform.; PackageReference: AXIAL-0.3; Publisher: Altium Limited; PackageDescription: Axial Device, Thru-Hole; 2 Leads; 0.3 in Pin Spacing; Value: 0R; Supplier 1: Digikey; Supplier Part Number 1: 311-0.0GRCT-ND; Package: 0603
R4-R20 R31-R36 = Res0603: Tolerance: 1%; Published: 8-Jun-2000; LatestRevisionDate: 17-Jul-2002; LatestRevisionNote: Re-released for DXP Platform.; PackageReference: AXIAL-0.3; Publisher: Altium Limited; PackageDescription: Axial Device, Thru-Hole; 2 Leads; 0.3 in Pin Spacing; Supplier 1: Digikey; Package: 0603
  R4-R7 R10-R13 R15-R20 R31-R36: Value: 10k; Supplier Part Number 1: 311-10.0KHRCT-ND
  R8 R9 R14: Value: 0R; Supplier Part Number 1: 311-0.0GRCT-ND
U1 U7-U10 = SN74AVC4T774: 4-Bit Dual-Supply Bus Transceiver With Configurable Voltage-Level Shifting and 3-State Outputs With Independent Direction Control Inputs; MPN: SN74AVC4T77PW; MF: Texas Instruments; Created: 2020_05_Kreppel; Supplier 1: Digikey; Supplier Part Number 1: 296-23611-5-ND; LCSC Part Number: C129363
  U7-U10: Parameter 1: *
X1 = HSEC8-140-01-XX-DV-A-BL-CARD: Mating Card Layout for HSEC8-140-01-XX-DV-A-BL; MF: SAMTEC; Created: 2018_04_23_AGeiger; Value: HSEC8-140-01-XX-DV-A-BL-CARD

## Sheet SPI_LVDS.SchDoc
size A4; Author: T. Kreppel; CompanyName: Universidad de Santiago de Chile; Organization: USACH DIE; Address1: Avenida Ecuador Nº 3519; Address2: Estación Central, Santiago; Address3: Chile; Revision: Rev03; SheetNumber: 4; SheetTotal: 5
Used 3 times, as channels LVDS1, LVDS2, LVDS3. Parts and nets are listed once, with the designators drawn on the sheet.
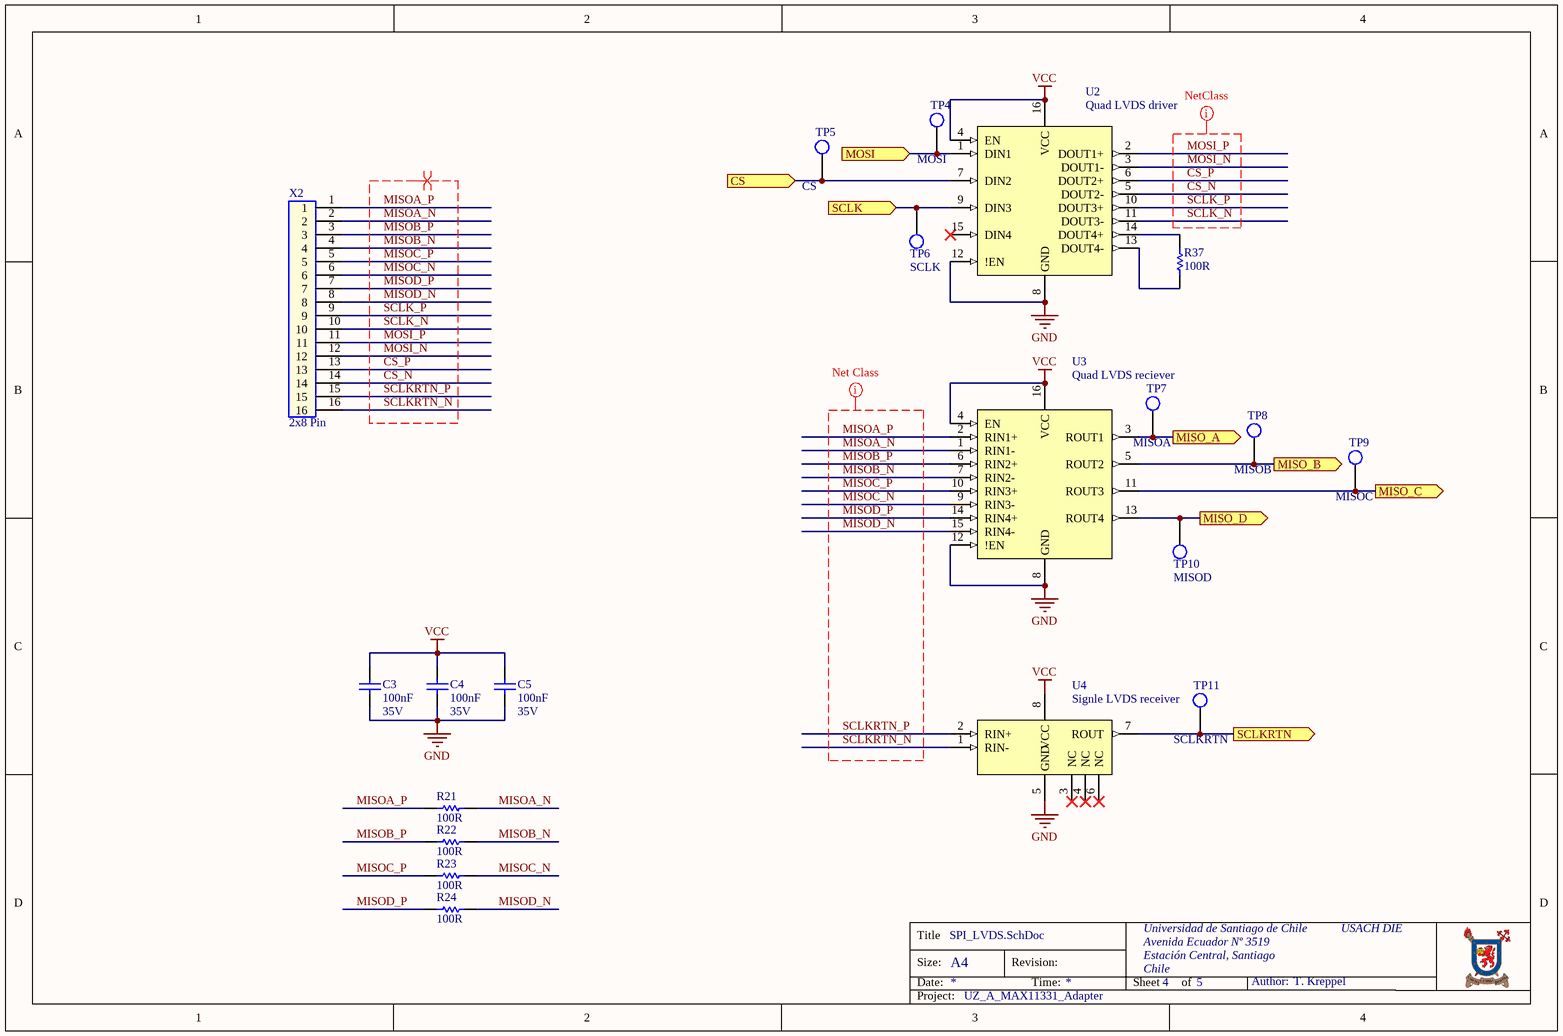
[diagram p3: SPI_LVDS.SchDoc]

### Parts
C3  100nF  Voltage: 35V  [CAP_0603]
C4  100nF  Voltage: 35V  [CAP_0603]
C5  100nF  Voltage: 35V  [CAP_0603]
R21  100R  [RES_0603]
R22  100R  [RES_0603]
R23  100R  [RES_0603]
R24  100R  [RES_0603]
R37  100R  [RES_0603]
TP4  MOSI  [TP_1.6mm]  (no BOM)
TP5  CS  [TP_1.6mm]  (no BOM)
TP6  SCLK  [TP_1.6mm]  (no BOM)
TP7  MISOA  [TP_1.6mm]  (no BOM)
TP8  MISOB  [TP_1.6mm]  (no BOM)
TP9  MISOC  [TP_1.6mm]  (no BOM)
TP10  MISOD  [TP_1.6mm]  (no BOM)
TP11  SCLKRTN  [TP_1.6mm]  (no BOM)
U2  Quad LVDS driver  [TSOP65P640X120-16N]
U3  Quad LVDS reciever  [TSOP65P640X120-16N]
U4  Signle LVDS receiver  [SOIC127P600X170_HS-9N_no_THP]
X2  2x8 Pin  [EHF-108-01-F-D]

### Ports
CS (in), MISO_A (out), MISO_B (out), MISO_C (out), MISO_D (out), MOSI (in), SCLK (in), SCLKRTN (out)

### Nets
GND: C3.2 C4.2 C5.2 U2.8(GND) U2.12(!EN) U3.8(GND) U3.12(!EN) U4.5(GND)
VCC: C3.1 C4.1 C5.1 U2.4(EN) U2.16(VCC) U3.4(EN) U3.16(VCC) U4.8(VCC)
CS: TP5.1 U2.7(DIN2) ; port CS
CS_N: U2.5(DOUT2-) X2.14
CS_P: U2.6(DOUT2+) X2.13
MISO_A: TP7.1 U3.3(ROUT1) ; port MISO_A
MISO_B: TP8.1 U3.5(ROUT2) ; port MISO_B
MISO_C: TP9.1 U3.11(ROUT3) ; port MISO_C
MISO_D: TP10.1 U3.13(ROUT4) ; port MISO_D
MISOA_N: R21.1 U3.1(RIN1-) X2.2
MISOA_P: R21.2 U3.2(RIN1+) X2.1
MISOB_N: R22.1 U3.7(RIN2-) X2.4
MISOB_P: R22.2 U3.6(RIN2+) X2.3
MISOC_N: R23.1 U3.9(RIN3-) X2.6
MISOC_P: R23.2 U3.10(RIN3+) X2.5
MISOD_N: R24.1 U3.15(RIN4-) X2.8
MISOD_P: R24.2 U3.14(RIN4+) X2.7
MOSI: TP4.1 U2.1(DIN1) ; port MOSI
MOSI_N: U2.3(DOUT1-) X2.12
MOSI_P: U2.2(DOUT1+) X2.11
SCLK: TP6.1 U2.9(DIN3) ; port SCLK
SCLK_N: U2.11(DOUT3-) X2.10
SCLK_P: U2.10(DOUT3+) X2.9
SCLKRTN: TP11.1 U4.7(ROUT) ; port SCLKRTN
SCLKRTN_N: U4.1(RIN-) X2.16
SCLKRTN_P: U4.2(RIN+) X2.15
NetR37_1: R37.1 U2.14(DOUT4+)
NetR37_2: R37.2 U2.13(DOUT4-)

Not connected (* = marked no-connect by the designer): U2 15(DIN4)*; U4 3(NC)* 4(NC)* 6(NC)*

### Channels
LVDS1: designators end in A; ports CS=CS1 MISO_A=MISO1_A MISO_B=MISO1_B MISO_C=MISO1_C MISO_D=MISO1_D MOSI=MOSI1 SCLK=SCLK1 SCLKRTN=SCLKRTN
LVDS2: designators end in B; ports CS=CS MISO_A=MISO2_A MISO_B=MISO2_B MISO_C=MISO2_C MISO_D=MISO2_D MOSI=MOSI2 SCLK=SCLK2 SCLKRTN=SCLKRTN
LVDS3: designators end in C; ports CS=CS3 MISO_A=MISO3_A MISO_B=MISO3_B MISO_C=MISO3_C MISO_D=MISO3_D MOSI=MOSI3 SCLK=SCLK3 SCLKRTN=SCLKRTN3

### Layout directives
differential pair: CS_N, CS_P, MISOA_N, MISOA_P, MISOB_N, MISOB_P, MISOC_N, MISOC_P, MISOD_N, MISOD_P, MOSI_N, MOSI_P, SCLK_N, SCLK_P, SCLKRTN_N, SCLKRTN_P
net class Match_Rtrn: MISOA_N, MISOA_P, MISOB_N, MISOB_P, MISOC_N, MISOC_P, MISOD_N, MISOD_P, SCLKRTN_N, SCLKRTN_P
net class Match: CS_N, CS_P, MOSI_N, MOSI_P, SCLK_N, SCLK_P

### Notes on the sheet
- Title
- Size:
- Date:
- A4
- Revision:
- Time:
- Sheet
- of
- Author:
- Project:

### Library data of the parts
C3-C5 = Cap_0603: as C10 on sheet Power supplies; Published: 8-Jun-2000; LatestRevisionDate: 17-Jul-2002; LatestRevisionNote: Re-released for DXP Platform.; PackageReference: RAD-0.3; Publisher: Altium Limited; Value: 100nF; Supplier 1: Digikey; Supplier Part Number 1: 399-7845-1-ND; Package: 0603; LCSC Part Number: C14663
R21-R24 R37 = Res0603: Tolerance: 1%; Published: 8-Jun-2000; LatestRevisionDate: 17-Jul-2002; LatestRevisionNote: Re-released for DXP Platform.; PackageReference: AXIAL-0.3; Publisher: Altium Limited; PackageDescription: Axial Device, Thru-Hole; 2 Leads; 0.3 in Pin Spacing; Value: 100R; Supplier 1: Digikey; Supplier Part Number 1: 311-100HRCT-ND; Package: 0603; LCSC Part Number: C22775
TP4-TP11 = TP: as TP1 on sheet Power supplies; Created: 2020_04_Kreppel; Supplier 1: Digikey; Supplier Part Number 1: 36-5006-ND
U2 = ADN4665: 3V, LVDS, Quad, CMOS Differential Line Driver; MPN: ADN4665ARUZ; MF: Analog Devices; Created: 2020_05_Kreppel; Supplier 1: Digikey; Supplier Part Number 1: ADN4665ARUZ-ND; LCSC Part Number: C658627
U3 = ADN4666: 3V, LVDS, quad, CMOS Differential Line Receiver; MPN: ADN4666ARUZ; MF: Analog Devices; Created: 2020_05_Kreppel; Supplier 1: Digikey; Supplier Part Number 1: ADN4666ARUZ-ND; LCSC Part Number: C658631
U4 = ADN4662: Single, 3V, CMOS, LVDS High Speed Differential Receiver; MPN: ADN4662BRZ; MF: Analog Devices; Created: 2020_05_Kreppel; Supplier 1: Digikey; Supplier Part Number 1: ADN4662BRZ-ND; LCSC Part Number: C658624
X2 = EHF-108-01-F-D: Dual Row, 2x8 Shrouded IDC Header with Ejectors 50 mil pitch; MF: Samtec; Created: 2020_05_Kreppel; MPN: EHF-108-01-F-D; Supplier 1: Digikey; Supplier Part Number 1: SAM9265-ND; LCSC Part Number: C17569033

## Nets that join several sheets
1.8V: Power supplies (C17.1 D3.2 U6.2 U6.4), Interface Connector (16 pins)
3.3V: Principal (7 pins), Interface Connector (R1.2 X1.13 X1.14)
GND: Principal (9 pins), Power supplies (18 pins), Interface Connector (65 pins), LVDS1 (8 pins), LVDS2 (8 pins), LVDS3 (8 pins)
VCC: Power supplies (9 pins), Interface Connector (10 pins), LVDS1 (8 pins), LVDS2 (8 pins), LVDS3 (8 pins)
VIN: Principal (6 pins), Power supplies (BS1.1 D2.2 TP1.1), Interface Connector (F4.2)
ADCLK: Principal (P1.2), Interface Connector (X1.54)
Collective_FLT: Principal (P1.5), Interface Connector (X1.78)
CS: Interface Connector (U9.12), LVDS2 (TP5B.1 U2B.7)
CS1: Interface Connector (U7.12), LVDS1 (TP5A.1 U2A.7)
CS3: Interface Connector (X1.53), LVDS3 (TP5C.1 U2C.7)
I2C0_SCL: Principal (P1.4 R41.1 U11.6), Interface Connector (X1.49)
I2C0_SDA: Principal (P1.6 R40.1 U11.5), Interface Connector (X1.50)
MISO1_A: Interface Connector (U1.14), LVDS1 (TP7A.1 U3A.3)
MISO1_B: Interface Connector (U1.13), LVDS1 (TP8A.1 U3A.5)
MISO1_C: Interface Connector (U1.12), LVDS1 (TP9A.1 U3A.11)
MISO1_D: Interface Connector (U1.11), LVDS1 (TP10A.1 U3A.13)
MISO2_A: Interface Connector (U8.14), LVDS2 (TP7B.1 U3B.3)
MISO2_B: Interface Connector (U8.13), LVDS2 (TP8B.1 U3B.5)
MISO2_C: Interface Connector (U8.12), LVDS2 (TP9B.1 U3B.11)
MISO2_D: Interface Connector (U8.11), LVDS2 (TP10B.1 U3B.13)
MISO3_A: Interface Connector (U10.14), LVDS3 (TP7C.1 U3C.3)
MISO3_B: Interface Connector (U10.13), LVDS3 (TP8C.1 U3C.5)
MISO3_C: Interface Connector (U10.12), LVDS3 (TP9C.1 U3C.11)
MISO3_D: Interface Connector (U10.11), LVDS3 (TP10C.1 U3C.13)
MOSI1: Interface Connector (U7.13), LVDS1 (TP4A.1 U2A.1)
MOSI2: Interface Connector (U9.13), LVDS2 (TP4B.1 U2B.1)
MOSI3: Interface Connector (X1.47), LVDS3 (TP4C.1 U2C.1)
PS_ANL_GPIO_01: Principal (P1.1), Interface Connector (X1.56)
PS_ANL_GPIO_02: Principal (P1.3), Interface Connector (X1.59)
SCLK1: Interface Connector (U7.14), LVDS1 (TP6A.1 U2A.9)
SCLK2: Interface Connector (U9.14), LVDS2 (TP6B.1 U2B.9)
SCLK3: Interface Connector (X1.48), LVDS3 (TP6C.1 U2C.9)
SCLKRTN: Interface Connector (U7.11), LVDS1 (TP11A.1 U4A.7)
SCLKRTN: Interface Connector (U9.11), LVDS2 (TP11B.1 U4B.7)
SCLKRTN3: Interface Connector (R14.2), LVDS3 (TP11C.1 U4C.7)

## Assembly variants
SMD_Assembly: not fitted P1 R1 R3 TP1 TP2 TP3 TP4A TP4B TP4C TP5A TP5B TP5C TP6A TP6B TP6C TP7A TP7B TP7C TP8A TP8B TP8C TP9A TP9B TP9C TP10A TP10B TP10C TP11A TP11B TP11C